# EAGLE board rtiduino (EAGLE 6.5.0)
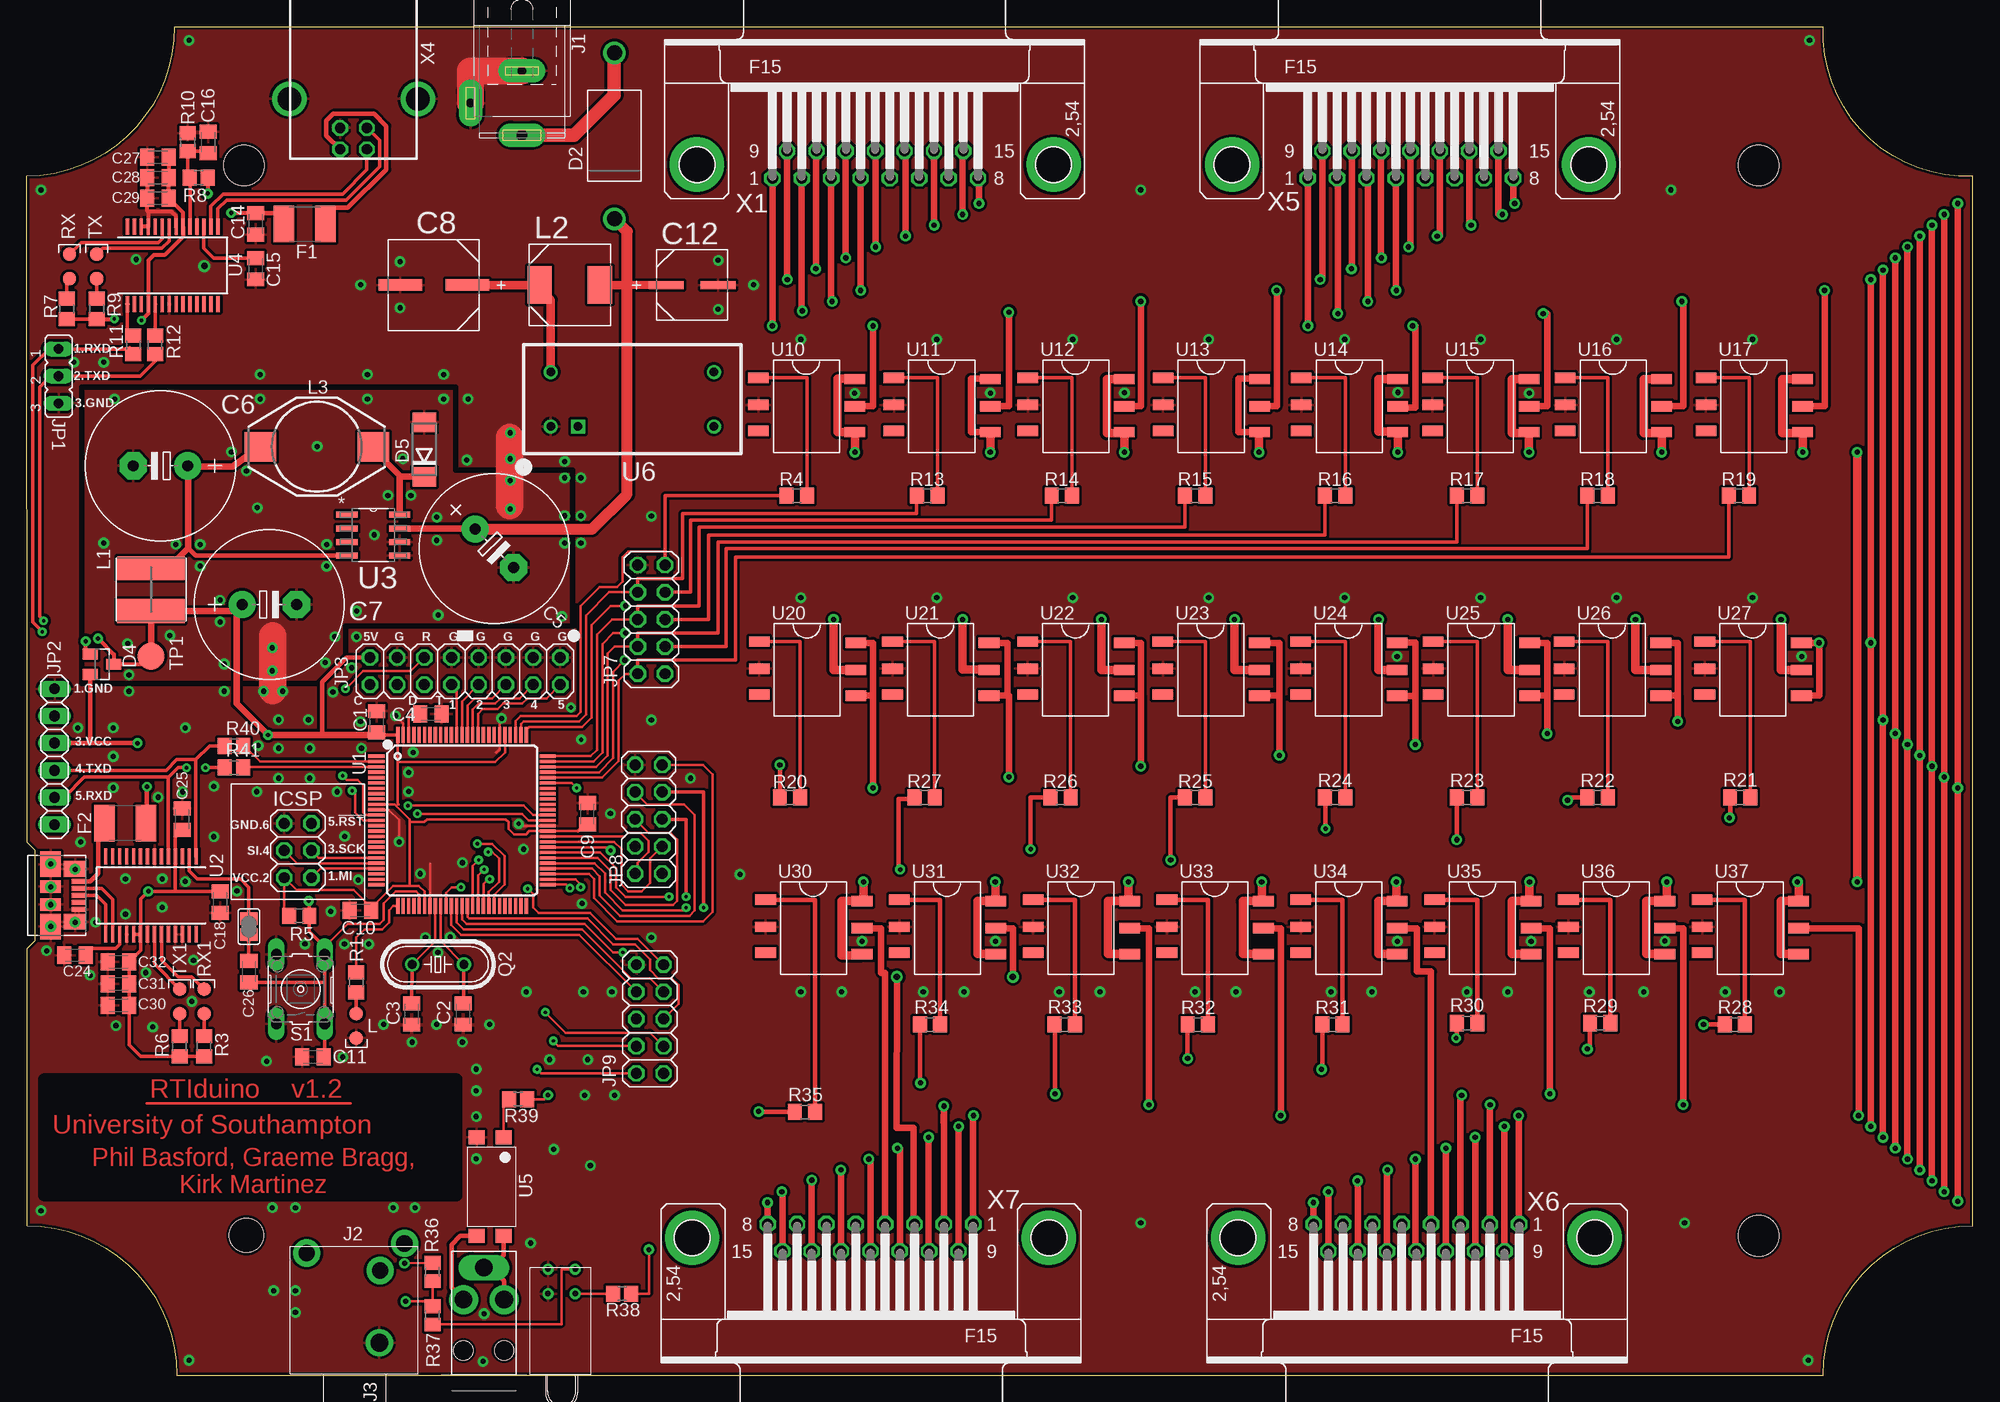
[diagram p4: board, top side]
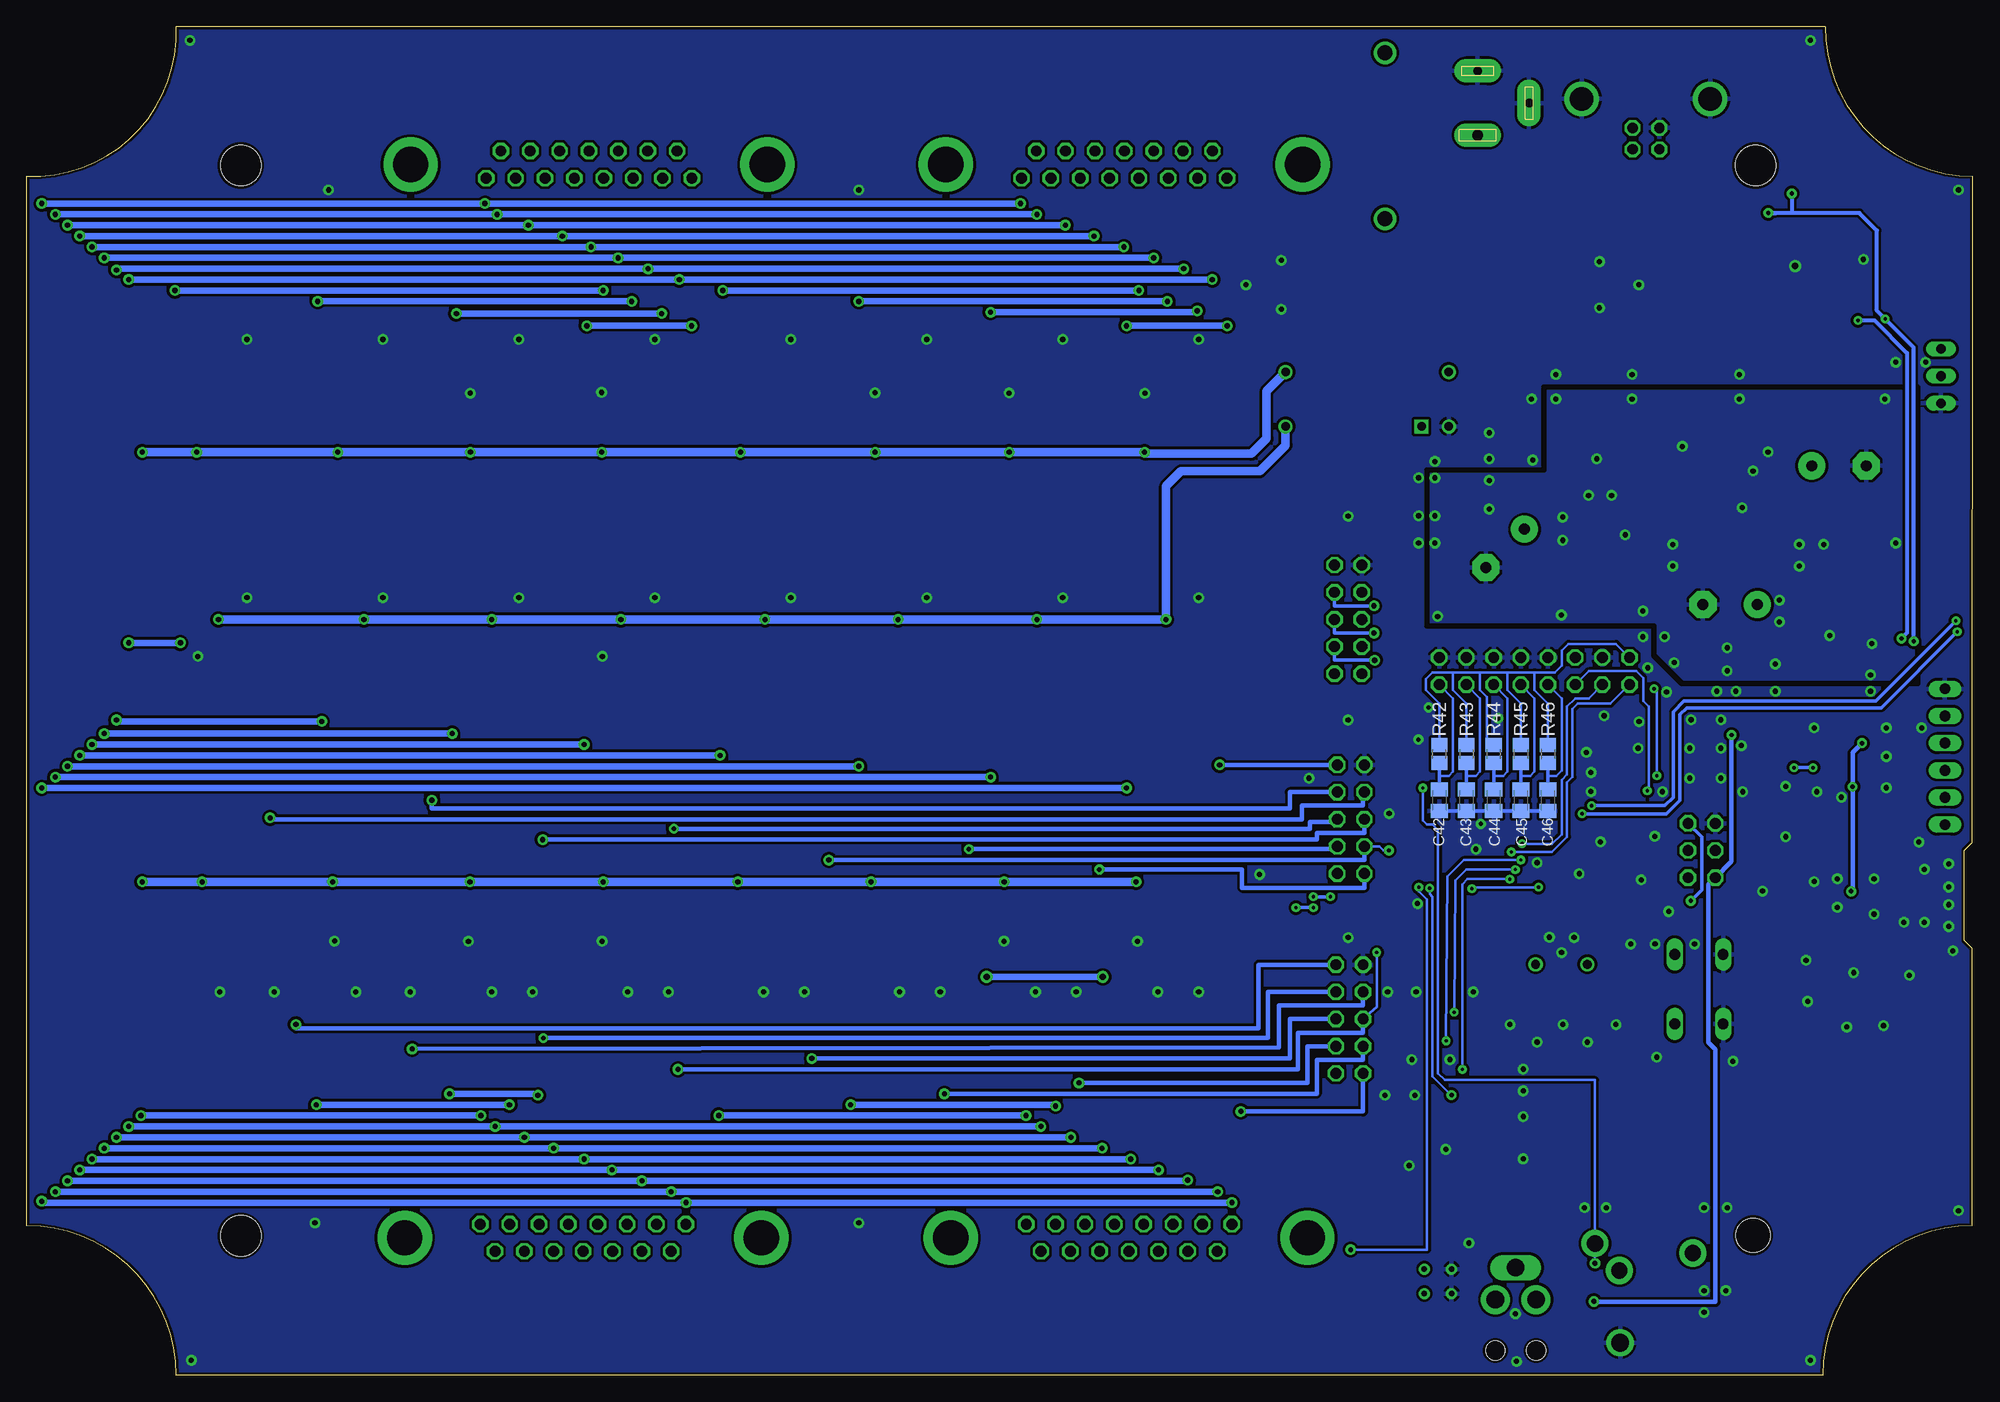
[diagram p5: board, bottom side, seen from below]

Size 181.79 x 125.98 mm. Coordinates in mm from the lower left corner, seen from the top.
Outline: 14.02,0 167.82,0 arc-90 181.79,13.97 181.79,112.01 arc-95 167.82,125.98 13.77,125.98 arc-90 0,112.01 0.05,49.78 0.81,49.02 0.81,40.64 0.05,39.88 0.05,13.97 arc-90 14.02,0
Copper layers (1*16): Top 0.035mm / dielectric 1.5mm / Bottom 0.035mm
Design rules "pcbtrain *": minimum track width 0.2mm, minimum drill 0.2mm, track to track 0.2mm, track to pad 0.2mm, pad to pad 0.2mm, via to via 0.2mm, smd to smd 0mil, copper to edge 10mil, drill to drill 0.2mm, minimum pad ring 10mil, minimum via ring 10mil, stop-mask expansion 0.125mm, vias tented up to drill 50mil, thermal gap 10mil
Net classes: 0 default: width 0.203 mm, drill 0.2 mm, clearance 0.127 mm; 1 power: width 0.203 mm, drill 0.2 mm, clearance 0.127 mm; 2 gnd: width 0.203 mm, drill 0.2 mm, clearance 0.127 mm; 3 usbvcc: width 0.203 mm, drill 0.2 mm, clearance 0.127 mm
Holes 3.2 mm at 20.53,13.06
Holes 3.8 mm at 20.29,113.02 161.79,113.02 161.79,13.02
tRestrict: 9 lines
bRestrict: 9 lines

## Footprints (pad centres in the part's own frame; a part is rotated, then mirrored left to right if it is on the bottom)
C0805K = smd 1.3 x 1.6: 1 -1,0; 2 1,0
E5-13 = drill 1.016 pad 2.54: + -2.54,0 | drill 1.016 pad 2.54 octagon: - 2.54,0
CAPAE830X1050N = smd 4.064 x 1.092: 1 -3.124,0; 2 3.124,0
CAPAE660X610N = smd 3.251 x 0.762: 1 -2.413,0; 2 2.413,0
DO-201AD = drill 1.4: 1 -12,-2.5; 2 3.5,-2.5
SOT23 = smd 1 x 1.4: 1 -0.95,-1.1; 2 0.95,-1.1; 3 0,1.1
DO214AA = smd 1.8 x 2.2: A 2.55,0; C -2.55,0
L1812 = smd 1.9 x 3.4: 1 -1.95,0; 2 1.95,0
2X03 = drill 1.016 octagon: 1 -2.54,-1.27; 2 -2.54,1.27; 3 0,-1.27; 4 0,1.27; 5 2.54,-1.27; 6 2.54,1.27
SPC4077 = drill 0.8 pad 2.184 long: 1 -3,0; 2 0,-4.8 | drill 1 pad 2.184 long: 3 3,0
3.5-JACK-RA = drill 1.651 pad 2.54: 1 8.319,2.921 | drill 1.524 pad 2.54: 2 1.524,11.303; 3 10.668,12.192; 4 8.382,9.652
2.5-JACK-RA-PRO = drill 1.65 pad 2.7: R 8.5,-1.9; S 8.5,1.9 | drill 1.6 long: T 11.5,0 | hole 1.8: 3.75,1.9; 3.75,-1.9
MOLEX_47346-0001 = smd 0.45 x 1.38: 1 -1.3,0; 2 -0.65,0; 3 0,0; 4 0.65,0; 5 1.3,0 | smd 1.475 x 2.1: M1 -2.462,-0.36; M2 2.462,-0.36 | smd 2.375 x 1.9: M3 -2.913,-2.66; M6 2.913,-2.66 | smd 1.175 x 1.9: M4 -0.82,-2.66; M5 0.85,-2.66
JP2 = drill 0.914 long: 1 -2.54,0; 2 0,0; 3 2.54,0
1X06 = drill 1.016 long: 1 -6.35,0; 2 -3.81,0; 3 -1.27,0; 4 1.27,0; 5 3.81,0; 6 6.35,0
2X08 = drill 1.016 octagon: 1 -8.89,-1.27; 2 -8.89,1.27; 3 -6.35,-1.27; 4 -6.35,1.27; 5 -3.81,-1.27; 6 -3.81,1.27; 7 -1.27,-1.27; 8 -1.27,1.27; 9 1.27,-1.27; 10 1.27,1.27; 11 3.81,-1.27; 12 3.81,1.27; 13 6.35,-1.27; 14 6.35,1.27; 15 8.89,-1.27; 16 8.89,1.27
2X05 = drill 1.016 octagon: 1 -5.08,-1.27; 2 -5.08,1.27; 3 -2.54,-1.27; 4 -2.54,1.27; 5 0,-1.27; 6 0,1.27; 7 2.54,-1.27; 8 2.54,1.27; 9 5.08,-1.27; 10 5.08,1.27
0805RND = smd 1.27 x 1.27: P$1 -1.143,0; P$2 1.143,0
WE-TPC_5818/5828 = smd 2.2 x 6.3: 1 -2,0; 2 2.01,0
INDM7676X355N = smd 2.261 x 3.505: 1 -2.819,0; 2 2.819,0
DO3316P = smd 2.92 x 2.79: 1 -5.28,0; 2 5.28,0
HC49/S = drill 0.813: 1 -2.413,0; 2 2.413,0
R0805 = smd 1.3 x 1.5: 1 -0.95,0; 2 0.95,0
R0805' = smd 1.3 x 1.5: 1 -0.85,0; 2 0.85,0
SJ = smd 1.168 x 1.6: 1 -0.762,0; 2 0.762,0
B3F-10XX = drill 1.016 long: 1 -3.251,2.261; 2 3.251,2.261; 3 -3.251,-2.261; 4 3.251,-2.261
B2,54 = smd 2.54 x 2.54: TP 0,0
TQFP100 = smd 1.5 x 0.3: 1 -8,6; 2 -8,5.5; 3 -8,5; 4 -8,4.5; 5 -8,4; 6 -8,3.5; 7 -8,3; 8 -8,2.5; 9 -8,2; 10 -8,1.5; 11 -8,1; 12 -8,0.5; 13 -8,0; 14 -8,-0.5; 15 -8,-1; 16 -8,-1.5; 17 -8,-2; 18 -8,-2.5; 19 -8,-3; 20 -8,-3.5; 21 -8,-4; 22 -8,-4.5; 23 -8,-5; 24 -8,-5.5; 25 -8,-6; 51 8,-6; 52 8,-5.5; 53 8,-5; 54 8,-4.5; 55 8,-4; 56 8,-3.5; 57 8,-3; 58 8,-2.5; 59 8,-2; 60 8,-1.5; 61 8,-1; 62 8,-0.5; 63 8,0; 64 8,0.5; 65 8,1; 66 8,1.5; 67 8,2; 68 8,2.5; 69 8,3; 70 8,3.5; 71 8,4; 72 8,4.5; 73 8,5; 74 8,5.5; 75 8,6 | smd 0.3 x 1.5: 26 -6,-8; 27 -5.5,-8; 28 -5,-8; 29 -4.5,-8; 30 -4,-8; 31 -3.5,-8; 32 -3,-8; 33 -2.5,-8; 34 -2,-8; 35 -1.5,-8; 36 -1,-8; 37 -0.5,-8; 38 0,-8; 39 0.5,-8; 40 1,-8; 41 1.5,-8; 42 2,-8; 43 2.5,-8; 44 3,-8; 45 3.5,-8; 46 4,-8; 47 4.5,-8; 48 5,-8; 49 5.5,-8; 50 6,-8; 76 6,8; 77 5.5,8; 78 5,8; 79 4.5,8; 80 4,8; 81 3.5,8; 82 3,8; 83 2.5,8; 84 2,8; 85 1.5,8; 86 1,8; 87 0.5,8; 88 0,8; 89 -0.5,8; 90 -1,8; 91 -1.5,8; 92 -2,8; 93 -2.5,8; 94 -3,8; 95 -3.5,8; 96 -4,8; 97 -4.5,8; 98 -5,8; 99 -5.5,8; 100 -6,8
SSOP28 = smd 0.381 x 1.499: 1 -4.225,-3.625; 2 -3.575,-3.625; 3 -2.925,-3.625; 4 -2.275,-3.625; 5 -1.625,-3.625; 6 -0.975,-3.625; 7 -0.325,-3.625; 8 0.325,-3.625; 9 0.975,-3.625; 10 1.625,-3.625; 11 2.275,-3.625; 12 2.925,-3.625; 13 3.575,-3.625; 14 4.225,-3.625; 15 4.225,3.625; 16 3.575,3.625; 17 2.925,3.625; 18 2.275,3.625; 19 1.625,3.625; 20 0.975,3.625; 21 0.325,3.625; 22 -0.325,3.625; 23 -0.975,3.625; 24 -1.625,3.625; 25 -2.275,3.625; 26 -2.925,3.625; 27 -3.575,3.625; 28 -4.225,3.625
SOIC127P620X175-8N = smd 1.981 x 0.559: 1 -2.464,1.905; 2 -2.464,0.635; 3 -2.464,-0.635; 4 -2.464,-1.905; 5 2.464,-1.905; 6 2.464,-0.635; 7 2.464,0.635; 8 2.464,1.905
DIP4-SMD = smd 1.3 x 1.5: P$1 -4.65,-4.15; P$2 -4.65,-6.68; P$3 4.55,-6.68; P$4 4.55,-4.15
LDU08 = drill 0.8: 1 -7.62,-2.54; 7 7.62,-2.54; 8 7.62,2.54; 14 -7.62,2.54 | drill 0.8 square: 2 -5.08,-2.54
SOP6 = smd 1.93 x 0.965: 1 -4.318,6.985; 2 -4.318,4.445; 3 -4.318,2.032; 4 4.699,1.905; 5 4.699,4.318; 6 4.699,6.858
122-000-04-52 = drill 0.508: P$1 -1.27,4.826; P$2 1.27,4.826; P$3 -1.27,2.54; P$4 1.27,2.54
F15HP = drill 1.016 octagon: 1 -9.601,-1.27; 2 -6.858,-1.27; 3 -4.115,-1.27; 4 -1.372,-1.27; 5 1.372,-1.27; 6 4.115,-1.27; 7 6.858,-1.27; 8 9.601,-1.27; 9 -8.23,1.27; 10 -5.486,1.27; 11 -2.743,1.27; 12 0,1.27; 13 2.743,1.27; 14 5.486,1.27; 15 8.23,1.27 | drill 3.302 pad 5.08: G1 -16.662,0; G2 16.662,0
PN61729 = drill 0.95 octagon: 1 1.25,4.71; 2 -1.25,4.71; 3 -1.25,2.71; 4 1.25,2.71 | drill 2.2: P$1 -6,0; P$2 6,0

## Placement (x,y rotation side)
C1  100n  [C0805K]  32.69,61.04 90 top
C2  22p  [C0805K]  40.77,33.75 90 top
C3  22p  [C0805K]  35.94,33.75 90 top
C4  100n  [C0805K]  37.76,61.78 0 top
C5  68uF  [E5-13]  43.67,77.25 315 top
C6  120uF  [E5-13]  12.5,84.96 180 top
C7  100uF  [E5-13]  22.66,72.01 0 top
C8  47UF  [CAPAE830X1050N]  38.02,101.85 180 top
C9  100n  [C0805K]  52.38,52.45 90 top
C10  100n  [C0805K]  31.17,43.43 180 top
C11  22p  [C0805K]  26.74,29.74 180 top
C12  10UF  [CAPAE660X610N]  62.16,101.85 0 top
C14  100n  [C0805K]  21.39,107.57 270 top
C15  100n  [C0805K]  21.39,103.38 90 top
C16  100n  [C0805K]  16.94,115.19 270 top
C18  100nF  [C0805K]  18.09,44.2 270 top
C24  100nF  [C0805K]  4.5,39.24 0 top
C25  100nF  [C0805K]  14.53,51.94 90 top
C26  100nF  [C0805K]  20.75,37.72 270 top
C27  100nF  [C0805K]  12.24,113.79 180 top
C28  100nF  [C0805K]  12.24,111.89 180 top
C29  4.7uF  [C0805K]  12.24,109.98 180 top
C30  100nF  [C0805K]  8.56,34.54 180 top
C31  100nF  [C0805K]  8.56,36.58 180 top
C32  4.7uF  [C0805K]  8.56,38.61 180 top
C42  100n  [C0805K]  49.84,53.72 270 bottom
C43  100n  [C0805K]  47.3,53.72 270 bottom
C44  100n  [C0805K]  44.76,53.72 270 bottom
C45  100n  [C0805K]  42.22,53.72 270 bottom
C46  100n  [C0805K]  39.68,53.72 270 bottom
D2  SF37  [DO-201AD]  52.4,120.04 90 top
D4  BAT54C  [SOT23]  7.04,66.42 270 top
D5  MBRS130  [DO214AA]  37.14,86.49 90 top
F1  500mA  [L1812]  25.96,107.57 0 top
F2  500mA  [L1812]  9.2,51.56 180 top
ICSP  ICSP  [2X03]  25.32,49.02 90 top
J1  DCJ0202  [SPC4077]  46.25,118.85 270 top
J2  3.5MM-JACK  [3.5-JACK-RA]  24.62,0.12 0 top
J3  2.5MM-JACKPRO  [2.5-JACK-RA-PRO]  42.7,-1.44 90 top
J4  USB PROG  [MOLEX_47346-0001]  4.88,44.83 270 top
JP1  [JP2]  2.97,93.34 270 top
JP2  [1X06]  2.59,57.78 270 top
JP3  [2X08]  40.95,65.79 0 top
JP7  [2X05]  58.34,70.61 90 top
JP8  [2X05]  58.09,51.94 90 top
JP9  [2X05]  58.22,33.27 90 top
L  [0805RND]  30.79,32.64 270 top
L1  3uH  [WE-TPC_5818/5828]  11.61,73.41 270 top
L2  DR73-680-R  [INDM7676X355N]  50.73,101.85 0 top
L3  330uH (DO3308P-334)  [DO3316P]  27.1,86.74 180 top
Q2  16MHz  [HC49/S]  38.42,38.39 180 top
R1  1K  [R0805]  30.79,36.7 270 top
R3  1k  [R0805]  16.56,30.73 270 top
R4  560  [R0805]  71.93,82.17 0 top
R5  10K  [R0805]  25.45,42.93 180 top
R6  1k  [R0805]  14.28,30.73 270 top
R7  1k  [R0805]  3.74,99.63 270 top
R8  4K7  [R0805']  16.05,111.89 180 top
R9  1k  [R0805]  6.53,99.63 270 top
R10  10K  [R0805']  15.04,115.19 90 top
R11  1K  [R0805']  9.96,96.27 270 top
R12  1K  [R0805']  11.99,96.27 270 top
R13  560  [R0805]  84.13,82.17 0 top
R14  560  [R0805]  96.7,82.17 0 top
R15  560  [R0805]  109.15,82.17 0 top
R16  560  [R0805]  122.23,82.17 0 top
R17  560  [R0805]  134.54,82.17 0 top
R18  560  [R0805]  146.74,82.17 0 top
R19  560  [R0805]  159.94,82.17 0 top
R20  560  [R0805]  71.3,53.98 0 top
R21  560  [R0805]  160.07,53.98 0 top
R22  560  [R0805]  146.74,53.98 0 top
R23  560  [R0805]  134.54,53.98 0 top
R24  560  [R0805]  122.23,53.98 0 top
R25  560  [R0805]  109.15,53.98 0 top
R26  560  [R0805]  96.57,53.98 0 top
R27  560  [R0805]  83.87,53.98 0 top
R28  560  [R0805]  159.56,32.77 0 top
R29  560  [R0805]  146.99,32.89 0 top
R30  560  [R0805]  134.54,32.89 0 top
R31  560  [R0805]  121.97,32.77 0 top
R32  560  [R0805]  109.4,32.77 0 top
R33  560  [R0805]  96.95,32.77 0 top
R34  560  [R0805]  84.38,32.77 0 top
R35  560  [R0805]  72.7,24.59 0 top
R36  10K  [R0805']  37.9,9.65 90 top
R37  560  [R0805']  37.9,5.59 270 top
R38  560  [R0805']  55.61,7.62 180 top
R39  560  [R0805']  45.9,25.78 180 top
R40  1K  [R0805']  19.36,58.8 0 top
R41  1K  [R0805']  19.36,56.77 0 top
R42  10k  [R0805']  49.84,58.04 270 bottom
R43  10k  [R0805']  47.3,58.04 270 bottom
R44  10k  [R0805']  44.76,58.04 270 bottom
R45  10k  [R0805']  42.22,58.04 270 bottom
R46  10k  [R0805']  39.68,58.04 270 bottom
RESET-EN  [SJ]  20.75,41.91 270 top
RX  [0805RND]  3.99,103.6 90 top
RX1  [0805RND]  16.56,34.92 90 top
S1  [B3F-10XX]  25.58,36.07 90 top
TP1  TPB2,54  [B2,54]  11.61,67.18 180 top
TX  [0805RND]  6.53,103.6 90 top
TX1  [0805RND]  14.28,34.92 90 top
U1  ATMEGA2560AU  [TQFP100]  40.66,51.83 0 top
U2  FT232RL  [SSOP28]  11.61,44.83 180 top
U3  LM2594HVM-5.0  [SOIC127P620X175-8N]  32.38,78.49 0 top
U4  FT232RL  [SSOP28]  13.63,103.69 0 top
U5  FOD852  [DIP4-SMD]  48.69,17.56 270 top
U6  LED-DRIVER  [LDU08]  56.57,91.19 0 top
U10  AQV252G  [SOP6]  72.67,86.21 0 top
U11  AQV252G  [SOP6]  85.31,86.21 0 top
U12  AQV252G  [SOP6]  97.83,86.21 0 top
U13  AQV252G  [SOP6]  110.48,86.21 0 top
U14  AQV252G  [SOP6]  123.38,86.21 0 top
U15  AQV252G  [SOP6]  135.64,86.21 0 top
U16  AQV252G  [SOP6]  148.04,86.21 0 top
U17  AQV252G  [SOP6]  161.19,86.21 0 top
U20  AQV252G  [SOP6]  72.74,61.57 0 top
U21  AQV252G  [SOP6]  85.19,61.57 0 top
U22  AQV252G  [SOP6]  97.82,61.57 0 top
U23  AQV252G  [SOP6]  110.45,61.57 0 top
U24  AQV252G  [SOP6]  123.33,61.57 0 top
U25  AQV252G  [SOP6]  135.7,61.57 0 top
U26  AQV252G  [SOP6]  147.95,61.57 0 top
U27  AQV252G  [SOP6]  161.08,61.57 0 top
U30  AQV252G  [SOP6]  73.33,37.44 0 top
U31  AQV252G  [SOP6]  85.83,37.44 0 top
U32  AQV252G  [SOP6]  98.33,37.44 0 top
U33  AQV252G  [SOP6]  110.83,37.44 0 top
U34  AQV252G  [SOP6]  123.33,37.44 0 top
U35  AQV252G  [SOP6]  135.83,37.44 0 top
U36  AQV252G  [SOP6]  148.33,37.44 0 top
U37  AQV252G  [SOP6]  160.83,37.44 0 top
U$28  122-000-04-52  [122-000-04-52]  49.96,5.08 0 top
X1  [F15HP]  79.26,113.11 0 top
X4  [PN61729]  30.52,119.25 180 top
X5  [F15HP]  129.26,113.11 0 top
X6  [F15HP]  129.82,12.84 180 top
X7  [F15HP]  78.82,12.84 180 top

## Tracks (layer width: path | path; a pad name or v marks a point on that pad's centre or on a via)
+3V3
  Top 0.305: C15.2 17.47,104.38 16.55,105.29 U4.17
+3V3PROG
  Top 0.305: U2.17 8.68,40.26 8.31,39.88 6.02,39.88 C24.2
+5V  (via drill 0.3, 0.41, 0.46)
  Top 0.254: v35.39,6.89 37.86,6.89 37.9,6.86 R37.1 R36.1 | 35.77,51.56 35.77,51.94 34.38,53.33 U1.10 | 35.77,51.56 35.77,45.72 | 35.77,45.72 36.63,45.72 37.16,45.18 U1.31 | 35.77,45.72 34.21,45.72 32.44,43.94 C10.1 32.17,43.7 30.53,45.34 25.2,45.34 ICSP.2 24.05,43.37 R5.2 | 34.6,59.82 34.66,59.82 U1.100 34.66,57.28 | 51.52,50.83 U1.61 46.95,50.83 46.66,50.55 45.52,50.55 45.01,51.05 45.01,51.69 44.76,51.94 37.39,51.94 37.14,51.69 35.9,51.69 arc90 35.77,51.56 | 34.66,57.28 43.74,57.28 44.66,58.2 U1.80 | 34.66,57.28 34.66,53.34 34.72,53.34
  Top 0.305: 34.6,59.82 32.55,59.82 | 51.52,50.83 52.14,51.45 C9.1
  Top 0.356: C27.1 C28.1 C29.1 14.6,108.62 U4.20 14.6,106.37 12.88,104.65 11.86,104.65 11.35,104.14 U4.4 11.35,99.18 v10.72,98.55 | v6.66,68.83 8.14,67.35 D4.3 10.85,66.42 TP1.TP
  Top 0.406: 27.61,59.82 27.61,64.77 29.9,67.06 JP3.2
  Top 0.61: 19.61,71.5 19.5,71.4 L1.2 TP1.TP | 19.61,71.5 C7.+ | 19.61,71.5 19.61,62.74 v22.53,59.82 27.61,59.82 32.55,59.82 C1.1
  Bottom 0.254: R46.1 39.68,62.74 40.95,64.01 40.95,65.66 | R45.1 42.22,62.74 43.49,64.01 43.49,65.66 | R43.1 47.3,62.74 48.57,64.01 48.57,65.66 | 48.57,65.66 46.03,65.66 | 46.03,65.66 43.49,65.66 | 43.49,65.66 40.95,65.66 | 40.95,65.66 39.04,65.66 38.41,66.29 38.41,67.69 37.77,68.33 33.33,68.33 JP3.2 | 46.03,65.66 46.03,64.01 45.39,63.37 45.39,59.52 R44.1 | R42.1 49.84,62.74 51.11,64.01 51.11,65.02 50.47,65.66 48.57,65.66
  Bottom 0.356: v10.72,98.55 9.2,98.55 6.15,95.5 6.15,69.34 v6.66,68.83
  Bottom 0.406: v35.39,6.89 35.39,6.86 24.03,6.86 24.03,30.45 24.69,31.11 24.69,45.85 ICSP.2 22.53,48.01 v22.53,59.82
A0
  Top 0.254: U1.78 45.66,61.11 46.15,61.59 51.36,61.59 51.74,61.98 51.74,71.88 53.52,73.66 55.17,73.66 55.68,74.17 55.68,76.45 56.19,76.96 59.49,76.96 59.62,77.09
  Top 0.305: R4.1 59.62,82.17 59.62,77.09 JP7.9
A1
  Top 0.254: U1.77 46.16,60.84 46.41,61.09 51.61,61.09 52.25,61.72 52.25,70.99 54.41,73.15 JP7.8
  Top 0.305: 83.11,82.17 83.11,80.52 61.27,80.52 61.27,74.42 57.08,74.42 JP7.8
  Top 0.406: R13.1 83.11,82.17
A2  (via drill 0.48)
  Top 0.254: U1.76 46.66,60.33 | 46.66,60.33 46.66,60.45 | v55.93,71.88 54.53,71.88 52.76,70.1 52.76,61.47 51.87,60.58 46.92,60.58 46.66,60.33
  Top 0.305: R14.1 95.75,79.88 62.03,79.88 62.03,73.15 JP7.7
  Bottom 0.305: v55.93,71.88 59.62,71.88 JP7.7
A3
  Top 0.254: U1.75 52.68,57.83 53.27,58.42 53.27,69.22 54.66,70.61 JP7.6
  Top 0.305: R15.1 108.2,79.25 62.79,79.25 62.79,71.88 57.08,71.88 JP7.6
A4  (via drill 0.48)
  Top 0.254: U1.74 52.94,57.33 53.77,58.17 53.77,68.33 54.79,69.34 v55.93,69.34
  Top 0.305: R16.1 121.28,78.49 63.68,78.49 63.68,70.61 JP7.5
  Bottom 0.305: v55.93,69.34 59.62,69.34 JP7.5
A5
  Top 0.254: U1.73 53.2,56.83 54.28,57.91 54.28,67.44 54.92,68.07 JP7.4
  Top 0.305: R17.1 133.59,77.85 64.57,77.85 64.57,69.34 57.08,69.34 JP7.4
A6  (via drill 0.48)
  Top 0.254: U1.72 53.46,56.33 54.79,57.66 54.79,65.72 v55.87,66.8
  Top 0.305: R18.1 145.79,77.22 65.33,77.22 65.33,68.07 JP7.3
  Bottom 0.305: v55.87,66.8 59.62,66.8 JP7.3
A7
  Top 0.254: U1.71 53.73,55.83 55.3,57.4 55.3,64.9 55.93,65.53 JP7.2
  Top 0.305: R19.1 159,76.45 66.22,76.45 66.22,66.8 57.08,66.8 JP7.2
AREF
  Top 0.254: U1.98 35.66,61.52 35.87,61.72 36.96,61.72
  Top 0.305: 36.96,61.72 C4.1
B0  (via drill 0.48)
  Top 0.254: U1.53 52.53,46.83 53.01,46.35 53.01,44.58 55.17,42.42 63.17,42.42 64.06,43.31 64.06,56.13 63.17,57.02 JP8.9
  Top 0.406: R20.1 v70.35,57.02
  Bottom 0.406: v70.35,57.02 JP8.9
B1  (via drill 0.48)
  Top 0.254: U1.54 52.8,47.33 53.52,46.61 53.52,44.83 55.42,42.93 61.9,42.93 62.41,43.43 62.41,52.32 61.39,53.34 57.96,53.34 JP8.8
  Top 0.406: v159.06,52.07 159.12,52.07 R21.1
  Bottom 0.406: JP8.8 56.95,54.48 56.95,53.21 62.66,53.21 62.66,51.94 159.06,51.94 v159.06,52.07
B2  (via drill 0.3, 0.48)
  Top 0.254: U1.55 53.06,47.83 54.03,46.86 54.03,45.09 55.68,43.43 61.33,43.43 v61.58,43.69
  Top 0.305: v63.23,43.69 63.23,54.48 JP8.7
  Top 0.406: v143.94,53.72 143.94,53.98 R22.1
  Bottom 0.305: v61.58,43.69 v63.23,43.69
  Bottom 0.406: JP8.7 63.81,54.48 63.81,52.96 143.94,52.96 v143.94,53.72
B3  (via drill 0.48)
  Top 0.254: U1.56 53.32,48.33 54.53,47.12 54.53,45.34 55.93,43.94 60.38,43.94 60.76,44.32 60.76,50.04 60.12,50.67 58.09,50.67 JP8.6
  Top 0.406: v133.59,50.04 R23.1
  Bottom 0.406: JP8.6 56.82,50.67 61.27,50.67 61.27,50.04 v133.59,50.04
B4  (via drill 0.3, 0.41)
  Top 0.254: U1.57 48.79,48.83 53.58,48.83 55.04,47.37 55.04,45.59 55.93,44.7 v60,44.7
  Top 0.305: v61.58,44.7 61.58,51.94 JP8.5
  Top 0.406: R24.1 121.34,53.98 v121.34,51.05
  Bottom 0.305: v60,44.7 v61.58,44.7
  Bottom 0.406: v121.34,51.05 61.9,51.05 61.9,51.69 59.36,51.69 JP8.5
B5  (via drill 0.41, 0.48)
  Top 0.254: U1.58 54.23,49.33 v54.53,49.02
  Top 0.406: R25.1 106.86,53.98 v106.86,48.13
  Bottom 0.254: v54.53,49.02 55.04,49.02 55.42,49.4 JP8.4
  Bottom 0.406: v106.86,48.13 56.82,48.13 JP8.4
B6  (via drill 0.41)
  Top 0.254: U1.59 54.87,49.83 55.55,49.15 55.55,45.85 56.19,45.21 57.46,45.21 58.22,45.97 58.22,48.26 JP8.3
  Top 0.406: R26.1 93.78,53.98 v93.78,49.15
  Bottom 0.406: v93.78,49.15 59.36,49.15 JP8.3
B7  (via drill 0.41)
  Top 0.254: U1.60 55.84,50.33 56.19,50.67 57.33,50.67 58.09,49.91 58.09,48.9 57.08,47.88 57.08,47.37 56.82,47.12 JP8.2
  Top 0.406: R27.1 82.92,53.85 81.46,53.85 81.46,47.24 v81.59,47.24
  Bottom 0.406: v81.59,47.24 68.25,47.24 68.25,45.53 56.82,45.53 JP8.2
C0  (via drill 0.3, 0.48)
  Top 0.254: JP9.9 57.08,40.77 55.04,40.77 52.63,43.18 47.8,43.18 47.3,43.69 47.3,44.58 47.3,44.83 47.3,44.96 v46.79,45.47 | U1.35 39.16,45.08 39.68,45.59 v40.56,45.59
  Top 0.406: v156.64,32.77 R28.1
  Bottom 0.254: v40.56,45.59 46.66,45.59 v46.79,45.47
  Bottom 0.406: JP9.9 66.73,38.35 66.73,32.38 156.64,32.38 v156.64,32.77
C1  (via drill 0.48)
  Top 0.254: U1.36 39.66,42.05 40.56,41.15 51.61,41.15 JP9.8
  Top 0.406: v145.78,30.48 146.04,30.73 R29.1
  Bottom 0.406: JP9.8 56.95,34.54 64.82,34.54 64.82,30.61 v145.78,30.48
C2  (via drill 0.41)
  Top 0.254: U1.37 40.16,42.31 40.82,41.66 51.87,41.66 56.44,37.08 58.22,37.08 JP9.7
  Top 0.305: 59.55,35.81 JP9.7
  Top 0.406: v133.53,31.5 133.59,31.5 R30.1
  Bottom 0.406: JP9.7 65.84,35.81 65.84,31.5 v133.53,31.5
C3  (via drill 0.3, 0.48)
  Top 0.254: U1.38 40.66,42.57 41.07,42.16 52.12,42.16 54.79,39.5 v55.68,39.5
  Top 0.406: v120.96,28.57 121.02,28.57 R31.1
  Bottom 0.254: v55.68,39.5 55.68,34.42 JP9.6
  Bottom 0.406: JP9.6 56.95,32 63.04,32 63.04,28.57 v120.96,28.57
C4  (via drill 0.48)
  Top 0.254: U1.39 41.16,42.83 41.33,42.67 52.38,42.67 54.79,40.26 56.82,40.26 58.22,38.86 58.22,37.85 58.98,37.08 60.25,37.08 60.88,36.45 60.88,34.67 JP9.5
  Top 0.406: v108.45,29.59 108.45,29.34 R32.1
  Bottom 0.406: JP9.5 63.81,33.27 63.81,29.59 v108.45,29.59
C5  (via drill 0.3, 0.48)
  Top 0.254: JP9.4 56.95,30.79 49.66,30.79 v49.2,31.24 | U1.40 41.66,47.58 v42.22,48.13
  Top 0.406: v96.06,26.29 96.06,32.77 R33.1
  Bottom 0.254: v49.2,31.24 49.07,46.61 47.55,48.13 v42.22,48.13
  Bottom 0.406: JP9.4 56.95,29.46 61.27,29.46 61.27,26.29 v96.06,26.29
C6  (via drill 0.3, 0.48)
  Top 0.254: U1.41 42.16,46.68 v42.72,47.24 | v48.44,33.91 50.34,32 58.22,32 JP9.3
  Top 0.406: v83.49,27.3 83.43,27.05 R34.1
  Bottom 0.254: v48.44,33.91 48.31,46.23 47.3,47.24 v42.72,47.24
  Bottom 0.406: JP9.3 62.16,30.73 62.16,27.3 v83.49,27.3
C7  (via drill 0.3, 0.48)
  Top 0.254: U1.42 42.66,45.91 43.1,46.35 v43.23,46.35 | JP9.2 48.06,28.19 v47.68,28.57
  Top 0.406: v68.38,24.64 68.38,24.59 R35.1
  Bottom 0.254: v47.68,28.57 47.68,45.87 47.19,46.35 v43.23,46.35
  Bottom 0.406: JP9.2 56.95,24.64 v68.38,24.64
D+
  Top 0.305: U4.15 17.85,108.98 18.67,109.8 29.85,109.8 32.95,112.9 32.95,115.36 X4.3
D-
  Top 0.305: X4.2 31.77,112.62 29.52,110.36 18.34,110.36 17.2,109.22 U4.16
FIRE  (via drill 0.3, 0.46)
  Top 0.254: R36.2 v35.29,10.46 | U1.70 50.89,55.33 v51.36,54.86
  Bottom 0.254: v35.29,10.46 J2.3 35.29,27.58 49.33,27.58 49.96,28.22 49.96,50.93 50.47,51.44 50.98,51.44 51.36,51.82 v51.36,54.86
GND  (via drill 0.41, 0.48, 0.6)
  Top 0.254: U1.11 33.81,52.83 34.77,51.87 v34.77,49.84 | U1.32 37.66,47.78 | U1.62 45.95,51.33 | U1.99 35.16,60.9 v34.44,61.62 | 44.16,61.69 v44.35,61.37 44.38,61.34 | 43.87,58.17 44.16,58.46 U1.81 44.16,61.13 44.38,61.34 | 44.38,61.34 44.63,61.09
  Top 0.305: U4.25 | 45.95,51.33 v45.95,51.51
  Top 0.356: U4.21 13.95,108.28 13.51,108.71 11.35,108.71 | 11.35,108.71 U4.25 U4.26 | 11.35,108.71 11.24,108.82 C29.2 C28.2
  Top 2.54: J1.2 41.45,121.85 J1.1
  Top 2.591: 45.11,81.25 45.11,87.61 | 22.99,63.98 22.99,69.06
  Bottom 0.305: C42.2 C43.2 C44.2 C45.2 C46.2
  other vias: 36.09,58.19 77.34,91.74 102.54,91.8 128.09,91.82 140.36,91.74 128.02,67.16 140.54,40.54 153.04,40.56 90.5,40.54 51.79,59.39 78.03,40.54 128.04,40.54 165.81,67.16 90.02,91.77 66.63,46.79 10.21,104.24 16.59,103.63 14.56,54.51 9.22,46.38 12.65,46.38 5.03,49.81 6.43,42.32 28.4,43.33 11.76,32.54 15.57,38.76 12.65,43.71 17.48,50.32 14.81,60.48 21.54,81.05 32.46,78.51 45.16,83.59 45.16,80.92 22.94,65.81 22.94,67.97 54.51,52.48 18.44,66.45 9.55,65.43 13.36,69.11 9.42,68.35 16.21,77.62 16.21,75.59 28.02,77.62 28.02,75.59 33.73,82.19 35.89,82.19 19.13,86.26 38.3,78 38.3,80.16 7.19,94.64 4.4,94.64 12.27,54 52.4,29.49 48.85,29.49 40.69,31.11 35.99,31.11 38.28,32.77 43.23,32.77 33.33,32.77 51.87,44.07 46.41,49.15 36.76,46.86 40.69,47.88 1.32,15.37 15.16,1.4 1.32,110.74 15.16,124.71 166.55,124.71 166.42,1.4 13.92,77.62 20.52,84.48 35.13,85.62 50.24,80.29 50.24,77.75 18.06,70.38 18.06,72.42 38.43,71.02 38.41,39.5 39.55,40.92 37.24,40.89 58.34,61.21 58.34,40.89 58.34,80.26 50.83,62.38 31.27,58.57 26.44,58.57 26.32,61.24 28.98,54.51 26.44,55.78 21.49,54.51 23.52,55.78 21.62,58.83 23.52,58.57 22.12,63.91 23.9,63.91 23.52,61.24 18.44,63.91 45.16,85.62 45.16,88.04 38.94,91.21 50.24,83.85 30.96,46.28 51.99,35.81 46.66,35.81 49.23,21.11 52.66,19.58 22.4,29.34 29.52,29.72 19.64,45.24 14.81,46.13 8.08,54.89 8.08,57.81 8.08,60.48 4.78,60.48 104.07,110.74 153.59,110.74 97.72,96.77 110.42,96.77 85.02,96.77 72.32,96.77 123.12,96.77 135.81,96.77 148.51,96.77 161.22,96.77 85.02,72.64 97.72,72.64 72.32,72.64 110.42,72.64 123.12,72.64 135.81,72.64 148.51,72.64 161.22,72.64 72.32,35.81 83.75,35.81 96.45,35.81 109.15,35.81 121.85,35.81 134.54,35.81 145.97,35.81 158.67,35.81 163.75,35.81 151.05,35.81 138.35,35.81 125.66,35.81 112.96,35.81 100.26,35.81 87.56,35.81 76.12,35.81 104.07,14.22 154.86,14.22 27.89,66.57 49.99,70.89 8.21,91.21 21.79,91.21 31.83,91.21 27.13,86.77 41.1,85.5 21.79,93.5 31.83,93.5 38.94,93.5 41.23,91.21 51.77,83.85 50.24,85.37 51.77,77.75 51.77,80.29 9.55,63.91 7.19,77.75 30.81,68.99 28.78,68.99 30.81,71.4 34.88,104.04 34.88,99.72 31.19,101.88 67.9,101.88 64.59,104.17 64.59,99.59 2.24,41.94 2.24,47.78 4.52,47.27 4.52,42.32 2.24,43.97 2.24,45.62 1.86,39.65 9.22,43.08 5.92,37.36 8.33,32.66 11.13,37.62 29.67,40.28 31.95,40.28 25.99,40.28 29.69,50.34 17.48,55.02 41.99,24.16 41.99,20.22 47.07,12.34 42.72,5.74 42.62,1.3 31.17,61.06 30.35,66.09 28.6,63.83 15.42,34.92 25.1,7.9 25.1,5.87 23.06,7.9 36.27,15.65 34.24,15.65 22.94,15.65 25.1,15.65 41.99,26.57 41.99,28.6 62,55.78 35.66,56.31 35.66,54.53 54.66,35.81 52.12,26.16 54.92,26.16
  pour Bottom (isolate 0.254): -5.71,137.52 188.29,137.52 188.29,-13.48 -5.71,-13.48
  pour Top (isolate 0.254): -3.71,135.52 186.58,135.4 186.58,-9.6 -3.71,-9.48
  pour Top (isolate 0.254): 37.33,45.21 37.33,40.58 32.5,40.58 32.5,31.11 44.45,31.11 44.44,40.7 39.61,40.7 39.42,45.21
  pour Bottom (isolate 0.254): 39.49,45.21 37.33,45.21 37.33,41.91 32.5,41.91 32.5,31.11 44.44,31.11 44.44,41.91 39.49,41.91
LED_GND  (via drill 0.48)
  Top 0.813: U21.5 89.89,65.91 87.43,65.91 v87.43,70.61 | U27.5 163.88,65.89 v163.88,70.61 | U26.5 150.29,65.89 v150.29,70.61 | U25.5 138.35,65.89 v138.35,70.61 | U24.5 126.29,65.89 v126.29,70.61 | U23.5 112.83,65.89 v112.83,70.61 | U22.5 100.38,65.89 v100.38,70.61 | U20.5 75.36,65.89 v75.36,70.61
  Bottom 0.813: v163.88,70.61 v150.29,70.61 v138.35,70.61 v126.29,70.61 v112.83,70.61 v100.38,70.61 v87.43,70.61 v75.36,70.61 75.36,83.06 73.97,84.45 66.6,84.45 64.19,86.87 U6.7
LED_VCC  (via drill 0.48)
  Top 0.61: 78.16,44.3 U30.6 | 78.03,39.24 U30.4 | U31.6 90.48,44.3 | 90.53,39.37 U31.4 | U32.6 102.92,44.3 | 103.03,39.37 U32.4 | U33.6 115.37,44.3 | 115.53,39.37 U33.4 | U34.6 127.94,44.3 | 128.03,39.37 U34.4 | U35.6 140.39,44.3 | 140.53,39.37 U35.4 | U36.6 153.21,44.3 | 153.03,39.37 U36.4 | 165.53,39.37 U37.4 | U11.4 88.19,88.11 88.19,93.09 90.01,93.09 U11.6 | U13.4 113.21,88.11 113.21,93.09 115.18,93.09 U13.6
  Top 0.813: U10.6 77.37,93.09 75.74,93.09 75.74,88.11 U10.4 v77.37,86.23 | v115.11,86.23 115.11,88.11 U13.4 | v102.53,86.23 U12.4 102.53,88.01 100.89,88.01 100.89,93.07 U12.6 | U11.4 v90.01,86.23 | v165.91,86.23 165.91,88.11 U17.4 165.89,88.01 164.01,88.01 164.01,93.07 U17.6 | v152.73,86.23 U16.4 152.73,88.01 151.05,88.01 151.05,93.07 U16.6 | v140.34,86.23 U15.4 140.34,88.01 138.74,88.01 138.74,93.07 U15.6 | v128.08,86.23 U14.4 128.08,88.14 126.29,88.14 126.29,93.07 U14.6 | v165.41,46.1 165.53,46.1 U37.6 163.88,44.3 163.88,39.37 165.53,39.37 | v78.16,46.1 78.16,44.3 | U30.6 76.12,44.3 76.12,39.24 78.03,39.24 | 90.48,44.3 v90.48,46.1 | U31.6 88.83,44.3 88.83,39.37 90.53,39.37 | 102.92,44.3 v102.92,46.1 | U32.6 101.02,44.3 101.02,39.37 103.03,39.37 | 115.37,44.3 v115.37,46.1 | U33.6 113.59,44.3 113.59,39.37 115.53,39.37 | 127.94,44.3 v127.94,46.1 | U34.6 126.29,44.3 126.29,39.37 128.03,39.37 | 140.39,44.3 v140.39,46.1 | U35.6 138.74,44.3 138.74,39.37 140.53,39.37 | 153.21,44.3 v153.21,46.1 | U36.6 151.31,44.3 151.31,39.37 153.03,39.37 | v170.99,86.23 v170.99,46.1
  Bottom 0.813: v78.16,46.1 v90.48,46.1 v102.92,46.1 v115.37,46.1 v127.94,46.1 v140.39,46.1 v153.21,46.1 v165.41,46.1 v170.99,46.1 | v170.99,86.23 v165.91,86.23 v152.73,86.23 v140.34,86.23 v128.08,86.23 v115.11,86.23 v102.53,86.23 v90.01,86.23 v77.37,86.23 77.24,86.11 67.36,86.11 65.97,87.5 65.97,91.95 U6.8
M8RXD
  Top 0.305: U4.1 9.4,97.42 R11.1
  Top 0.406: U4.1 9.42,100.06
M8TXD
  Top 0.305: 12.04,100.06 U4.5 12,97.38 R12.1
N$1
  Top 0.305: U10.1 72.88,93.19 R4.2
N$2
  Top 0.305: L.P$1 R1.2
N$3
  cutout Top: 1.64,28.19 40.12,28.19 arc-90 40.69,27.63 40.69,16.82 arc-90 40.12,16.26 1.64,16.26 arc-90 1.07,16.82 1.07,27.63 arc-90
N$4
  Top 0.406: U3.4 15.78,76.58 15.09,77.27
  Top 0.61: L3.2 19.23,84.91 15.09,84.91 | 15.09,84.91 C6.+ | L1.1 11.7,75.31 13.13,75.31 15.09,77.27 15.09,84.91
N$5
  Top 0.305: U12.1 97.65,93.19 R14.2
N$6
  Top 0.254: Q2.1 38.66,40.55 U1.34
  Top 0.305: C2.2 40.83,34.8 Q2.1
N$7
  Top 0.254: Q2.2 38.16,40.55 U1.33
  Top 0.305: C3.2 Q2.2
N$8
  Top 0.305: U13.1 110.1,93.19 R15.2
N$9
  Top 0.305: U16.1 147.69,93.19 R18.2
N$10
  Top 0.305: U14.1 123.18,93.19 R16.2
N$11  (via drill 0.48)
  Top 0.61: X5.1 119.69,111.84 v119.69,98.04 | v129.47,98.04 129.72,98.04 129.72,90.42 128.08,90.42 U14.5
  Bottom 0.61: v119.69,98.04 v129.47,98.04
N$12
  Top 0.305: U15.1 135.5,93.19 R17.2
N$13
  Top 0.305: U11.1 85.08,93.19 R13.2
N$14  (via drill 0.6)
  Top 0.61: X7.3 82.86,14.11 82.86,23.11 81.27,23.11 v81.28,37.21 | v92.13,37.21 92.13,41.76 U31.5
  Bottom 0.61: v81.28,37.21 v92.13,37.21
N$15
  Top 0.305: 4.06,104.74 RX.P$2 5.07,105.82 12.27,105.82 12.65,106.2 U4.23
N$16
  Top 0.305: U17.1 160.89,93.19 R19.2
N$17
  Top 0.406: U37.1 160.51,44.42 R28.2
N$18
  Top 0.406: U36.1 147.94,44.42 R29.2
N$19
  Top 0.406: U35.1 135.5,44.42 R30.2
N$20
  Top 0.406: U34.1 122.92,44.42 R31.2
N$21
  Top 0.406: U33.1 110.35,44.42 R32.2
N$22
  Top 0.406: U32.1 97.9,44.42 R33.2
N$23
  Top 0.406: U31.1 85.33,44.42 R34.2
N$24
  Top 0.406: U30.1 73.65,44.42 R35.2
N$25
  Top 0.305: U20.1 72.25,68.56 R20.2
N$26
  Top 0.305: U27.1 161.02,68.56 R21.2
N$27
  Top 0.305: U26.1 147.69,68.56 R22.2
N$28
  Top 0.305: U25.1 135.5,68.56 R23.2
N$29
  Top 0.305: U24.1 123.18,68.56 R24.2
N$30
  Top 0.305: U23.1 110.1,68.56 R25.2
N$31
  Top 0.305: U22.1 97.52,68.56 R26.2
N$32
  Top 0.305: U21.1 84.82,68.56 R27.2
N$33  (via drill 0.48)
  Top 0.61: X1.1 v69.66,98.04 v69.65,98.04 | v79.05,98.04 79.05,90.53 U10.5
  Bottom 0.61: v69.65,98.04 v79.05,98.04
N$34  (via drill 0.48)
  Top 0.61: X6.1 139.37,14.11 v139.37,24.26 | v171.12,24.26 171.12,41.76 U37.5
  Bottom 0.61: v139.37,24.26 v171.12,24.26
N$35  (via drill 0.48)
  Top 0.61: X1.2 72.4,99.44 v72.44,99.44 | v91.75,99.31 91.75,90.53 U11.5
  Bottom 0.61: v72.44,99.44 72.44,99.31 v91.75,99.31
N$36  (via drill 0.48)
  Top 0.61: X1.3 75.15,100.33 v75.24,100.33 | v104.07,100.33 104.07,90.53 U12.5
  Bottom 0.61: v75.24,100.33 v104.07,100.33
N$37  (via drill 0.48)
  Top 0.61: X1.4 77.89,101.6 v77.9,101.35 | v116.77,101.35 116.77,90.53 U13.5
  Bottom 0.61: v77.9,101.35 v116.77,101.35
N$38  (via drill 0.48)
  Top 0.61: X6.3 133.94,26.16 v134.04,26.16 | v142.29,26.29 142.29,41.76 U35.5
  Bottom 0.61: v134.04,26.16 134.04,26.29 v142.29,26.29
N$39
  Top 0.61: X6.4 131.19,37.72 129.85,37.72 129.85,41.76 U34.5
N$40  (via drill 0.48)
  Top 0.61: X7.1 88.42,24.13 v88.44,24.26 | v117.15,24.26 117.15,41.76 U33.5
  Bottom 0.61: v88.44,24.26 v117.15,24.26
N$41  (via drill 0.48)
  Top 0.61: X7.2 v85.67,25.15 85.65,23.62 | v104.83,25.27 104.83,41.76 U32.5
  Bottom 0.61: v85.67,25.15 85.67,25.27 v104.83,25.27
N$42
  Top 0.61: X7.4 80.19,37.59 79.81,37.59 79.81,41.76 U30.5
N$43
  Top 0.813: U6.14 48.95,100.46 47.91,101.5 L2.1 C8.1
N$44
  Top 0.254: 11.23,25.4 30.28,25.4
N$45  (via drill 0.48)
  Top 0.61: X5.2 122.48,111.84 v122.48,99.19 | v141.66,99.19 142.04,99.19 142.04,90.55 140.34,90.55 U15.5
  Bottom 0.61: v122.48,99.19 v141.66,99.19
N$46  (via drill 0.48)
  Top 0.61: X5.3 125.27,111.84 v125.27,100.33 | v154.61,100.33 154.74,100.33 154.74,90.55 152.73,90.55 U16.5
  Bottom 0.61: v125.27,100.33 v154.61,100.33
N$47  (via drill 0.48)
  Top 0.61: X5.4 127.89,101.35 v127.94,101.35 | v167.95,101.35 167.95,90.53 U17.5
  Bottom 0.61: v127.94,101.35 v167.95,101.35
N$48
  Top 0.61: L3.1 32.38,86.54 34.85,84.07 34.85,83.82 | 34.85,83.82 34.85,80.4 U3.8 | D5.C 34.97,83.94 34.85,83.82
N$49  (via drill 0.48)
  Top 0.61: X6.2 136.68,25.27 v136.7,25.27 | v154.74,25.27 154.74,41.76 U36.5
  Bottom 0.61: v136.7,25.27 v154.74,25.27
N$50
  Top 0.305: U2.23 12.58,38.78 14.15,37.21 15.42,37.21 RX1.P$2
N$51
  Top 0.406: U5.P$4 44.54,11.21 43.38,10.06 | 43.38,10.06 J3.T | J3.R 44.6,8.84 43.38,10.06
N$52
  Top 0.305: U2.22 11.93,38.41 TX1.P$2
N$53
  Top 0.305: U4.22 13.3,105.96 12.62,105.28 7.08,105.28 TX.P$2
N$54
  Top 0.305: RX.P$1 3.74,102.45 R7.1
N$55
  Top 0.305: R9.1 TX.P$1
N$56
  Top 0.254: R37.2 37.95,5.2 38.2,4.78 49.96,4.78 49.96,9.91 U$28.P$2
N$57
  Top 0.254: R38.2 U$28.P$4
N$58
  Top 0.305: R3.1 RX1.P$1
N$59
  Top 0.254: U5.P$1 44.54,25.27 R39.2
N$60
  Top 0.406: X4.1 27.99,115.82 27.99,117.22 28.63,117.86 32.44,117.86 33.58,116.71 33.58,112.65 30,109.07 28.04,109.07 27.91,108.94 F1.2
N$61
  Top 0.406: U5.P$3 40.49,13.01 39.68,12.19 39.68,8.18 J3.S
N$62
  Top 0.305: R6.1 TX1.P$1
N$63
  Top 0.406: J4.1 5.92,46.13 6.66,46.86 6.66,51.61 F2.2
N$66
  Top 0.305: U2.2 15.18,47.1 15.93,46.35 19.99,46.35 20.75,45.59 RESET-EN.1 RESET-EN.2 C26.1
N$68
  Top 0.305: U4.19 15.25,111.84 R8.2 15.04,112.05 R10.1 16.79,114.34 C16.2
PB1
  Top 0.254: U1.20 27.29,48.33 ICSP.3
PB2
  Top 0.254: U1.21 25.25,47.83 ICSP.4
PB3
  Top 0.254: U1.22 27.45,47.33 ICSP.1
PB7
  Top 0.254: R1.1 30.79,40.89 31.55,41.66 33.2,41.66 33.83,42.29 33.83,43.43 34.23,43.83 U1.26
PROG_D+
  Top 0.305: J4.3 6.53,44.83 7.38,43.98 U2.15
PROG_D-
  Top 0.305: J4.2 7.02,45.48 8.03,44.47 U2.16
RESET  (via drill 0.41)
  Top 0.254: U1.30 36.66,44.92 36.37,45.21 34.47,45.21 33.33,44.07 33.33,42.55 32.95,42.16 29.97,42.16 27.84,40.03
  Top 0.305: 27.84,36.7 S1.4 27.84,40.03 26.4,41.47 R5.1 26.4,44.26 v26.34,44.32 | 27.84,36.7 S1.3 27.84,29.34 C11.1 | C26.2 27.82,36.72 27.84,36.7
  Bottom 0.305: ICSP.5 25.32,50.29 25.32,45.34 v26.34,44.32
ROW1  (via drill 0.48)
  Top 0.61: X7.8 v69.2,16.13 | v180.39,16.26 v180.39,54.86 v180.39,109.47 | X6.8 120.22,16.1 v120.19,16.13 | v88.95,109.47 88.95,111.84 X1.8 | X5.8 138.87,109.47 v138.99,109.47 | 79.05,63.5 77.44,63.5 U20.4 | 79.05,63.5 v79.05,54.86 | U20.6 79.05,68.43 79.05,63.5
  Bottom 0.61: v69.2,16.13 v120.19,16.13 180.14,16.13 v180.39,16.26 | v180.39,109.47 v138.99,109.47 v88.95,109.47 | v79.05,54.86 v180.39,54.86
ROW2  (via drill 0.48)
  Top 0.61: X7.9 87.05,22.48 v87.05,23.24 | X6.9 138.05,22.48 v138.04,23.24 | X5.9 121.04,102.49 v120.83,102.36 | v71.05,102.36 71.05,114.32 X1.9 | v172.26,23.24 v172.26,68.43 v172.26,102.36 | U27.6 v167.44,68.43 167.44,63.5 165.78,63.5 U27.4
  Bottom 0.61: v87.05,23.24 v138.04,23.24 v172.26,23.24 | v71.05,102.36 v120.83,102.36 v172.26,102.36 | v167.44,68.43 v172.26,68.43
ROW3  (via drill 0.48)
  Top 0.61: X6.10 135.31,21.46 v135.31,22.23 | v73.71,103.38 73.71,114.38 X1.10 | v173.41,22.23 v173.41,61.21 v173.41,103.25 | v84.25,22.23 84.25,11.57 X7.10 | X5.10 123.78,103.38 v123.75,103.38 | U26.6 154.23,68.43 154.23,63.5 | 154.23,63.5 153.28,63.5 U26.4 | 154.23,63.5 v154.23,61.09
  Bottom 0.61: v84.25,22.23 v135.31,22.23 v173.41,22.23 | v73.71,103.38 v123.75,103.38 173.41,103.38 v173.41,103.25 | v154.23,61.09 173.41,61.09 v173.41,61.21
ROW4  (via drill 0.48)
  Top 0.61: X6.11 132.56,20.45 v132.58,21.21 | v76.51,104.39 X1.11 | v174.55,21.21 v174.55,59.94 v174.55,104.39 | X7.11 81.56,21.21 v81.33,21.21 | X5.11 126.52,104.39 v126.54,104.39 | U25.6 142.04,68.43 142.04,63.5 | 142.04,63.5 140.78,63.5 U25.4 | 142.04,63.5 v142.04,59.94
  Bottom 0.61: v81.33,21.21 v132.58,21.21 v174.55,21.21 | v76.51,104.39 v126.54,104.39 v174.55,104.39 | v142.04,59.94 v174.55,59.94
ROW5  (via drill 0.48)
  Top 0.61: X5.12 129.26,105.41 v129.08,105.41 | v79.3,105.41 79.3,114.38 X1.12 | v175.69,20.19 v175.69,58.93 v175.69,105.41 | X7.12 78.82,20.19 v78.67,20.19 | v129.72,20.19 129.72,11.57 X6.12 | 129.72,63.48 v129.72,58.93 | U24.4 129.72,63.48 | 129.72,63.48 129.72,68.45 128.03,68.45 U24.6
  Bottom 0.61: v78.67,20.19 v129.72,20.19 v175.69,20.19 | v79.3,105.41 v129.08,105.41 v175.69,105.41 | v129.72,58.93 v175.69,58.93
ROW6  (via drill 0.48)
  Top 0.61: X7.13 76.07,18.54 v76.06,19.18 | X6.13 127.08,18.54 v127.12,19.18 | X5.13 132.01,106.43 v131.75,106.43 | v82.09,106.43 82.09,114.38 X1.13 | v176.84,19.18 v176.84,57.91 | v176.84,57.91 v176.84,106.43 | U23.6 117.02,68.43 117.02,63.5 | 117.02,63.5 115.78,63.5 | 117.02,63.5 v117.02,57.91 | v176.84,57.91 176.84,56.77
  Top 0.813: 115.78,63.5 U23.4
  Bottom 0.61: v76.06,19.18 v127.12,19.18 v176.84,19.18 | v82.09,106.43 v131.75,106.43 v176.84,106.43 | v117.02,57.91 v176.84,57.91
ROW7  (via drill 0.48)
  Top 0.61: X6.14 124.33,17.02 v124.32,18.16 | X5.14 134.75,107.44 v134.93,107.44 | v84.76,107.44 84.76,114.38 X1.14 | X7.14 73.33,17.59 v73.33,18.22 | v177.98,18.16 v177.98,56.9 | v177.98,56.9 v177.98,107.44 | U22.6 104.07,68.43 104.07,63.5 | 104.07,63.5 103.28,63.5 | 104.07,63.5 v104.07,56.9 | v177.98,56.9 177.98,55.5
  Top 0.813: 103.28,63.5 U22.4
  Bottom 0.61: v73.33,18.22 73.2,18.16 v124.32,18.16 v177.98,18.16 | v84.76,107.44 v134.93,107.44 v177.98,107.44 | v104.07,56.9 v177.98,56.9
ROW8  (via drill 0.48)
  Top 0.61: X5.15 137.5,108.46 v137.85,108.46 | v87.43,108.46 87.43,114.38 X1.15 | X7.15 70.59,17.14 v70.54,17.14 | v179.12,17.14 v179.12,55.88 v179.12,108.46 | 91.62,63.5 91.75,63.5 v91.75,55.88 | 91.62,63.5 89.89,63.5 | U21.6 91.62,68.43 91.62,63.5 | X6.15 v121.59,17.14
  Top 0.813: 89.89,63.5 U21.4
  Bottom 0.61: v87.43,108.46 v137.85,108.46 v179.12,108.46 | v70.54,17.14 v121.59,17.14 | v121.59,17.14 | v121.59,17.14 v179.12,17.14 | v91.75,55.88 v179.12,55.88
RUNNING  (via drill 0.3, 0.46)
  Top 0.254: U1.52 51.26,46.33 51.74,45.85 v51.74,45.59 | v58.12,11.73 58.12,7.62 R38.1
  Bottom 0.254: v58.12,11.73 50.98,11.73 50.98,44.45 51.74,45.21 v51.74,45.59
RXD  (via drill 0.3)
  Top 0.254: U1.63 46.9,51.83 46.28,52.45 v36.5,52.45
  Top 0.305: 9.62,96.01 R11.2 9.74,95.89 JP1.1 2.08,95.89 0.56,94.36 0.56,70.36 v1.45,69.47
  Bottom 0.305: v1.45,69.47 8.56,62.36 26.72,62.36 27.36,61.72 27.36,53.72 28.63,52.45 v36.5,52.45
RXD2  (via drill 0.3)
  Top 0.254: v29.52,56.01 29.9,55.63 30.91,55.63 31.42,55.12 31.42,52.58 31.68,52.32 U1.12 | JP3.6 35.87,65.79 31.42,65.79 v29.77,64.14
  Bottom 0.254: v29.52,56.01 29.52,63.88 v29.77,64.14
RXD_PROG
  Top 0.254: U1.2 21.79,57.33 20.32,58.8
  Top 0.305: 20.32,58.8 R40.2
RXDP
  Top 0.305: R40.1 17.07,58.8 15.8,57.53 | 15.8,57.53 15.8,48.49 U2.1 | JP2.4 13.01,56.52 14.02,57.53 15.8,57.53
SCL  (via drill 0.3)
  Top 0.254: U1.43 43.16,45.15 44.12,46.1 44.12,48.26 43.49,48.9 v43.1,48.9
  Bottom 0.254: v43.1,48.9 39.3,48.9 37.9,50.29 37.9,55.37 37.39,55.88 37.39,62.23 36.88,62.74 33.83,62.74 JP3.1
SDA  (via drill 0.3)
  Top 0.254: U1.44 43.66,44.88 44.63,45.85 44.63,48.51 43.49,49.66 v42.09,49.66
  Bottom 0.254: v42.09,49.66 39.3,49.66 38.41,50.55 38.41,55.63 37.9,56.13 37.9,62.48 37.14,63.25 35.87,63.25 JP3.3
SHUTTER  (via drill 0.3, 0.41)
  Top 0.254: U1.51 50.38,45.83 v50.73,45.49 | R39.1 48.31,25.78 v48.69,26.16
  Bottom 0.254: v48.69,26.16 50.47,27.94 50.47,44.7 50.73,44.96 v50.73,45.49
SW1
  Top 0.254: U1.89 40.16,64.03 JP3.7
  Bottom 0.254: 39.68,56.01 38.91,56.01 38.41,56.52 38.41,63.25 JP3.7
  Bottom 0.305: R46.2 39.68,56.01 C46.1
SW2
  Top 0.254: U1.88 40.66,62.97 JP3.9
  Bottom 0.254: 42.22,56.01 41.33,56.01 40.95,56.39 40.95,63.25 JP3.9
  Bottom 0.305: R45.2 42.22,56.01 C45.1
SW3
  Top 0.254: U1.87 41.16,62.58 41.84,63.25 43.49,63.25 JP3.11
  Bottom 0.254: 44.76,56.01 43.87,56.01 43.49,56.39 43.49,63.25 JP3.11
  Bottom 0.305: R44.2 44.76,56.01 C44.1
SW4
  Top 0.254: U1.86 41.66,62.19 42.22,62.74 43.74,62.74 44.25,63.25 46.03,63.25 JP3.13
  Bottom 0.254: 47.3,56.01 46.41,56.01 46.03,56.39 46.03,63.25 JP3.13
  Bottom 0.305: R43.2 47.3,56.01 C43.1
SW5
  Top 0.254: U1.85 42.16,61.8 42.6,62.23 43.99,62.23 44.5,62.74 46.28,62.74 46.79,63.25 48.57,63.25 JP3.15
  Bottom 0.254: 49.84,56.01 48.95,56.01 48.57,56.39 48.57,63.25 JP3.15
  Bottom 0.305: R42.2 49.84,56.01 C42.1
TXD  (via drill 0.3)
  Top 0.254: U1.64 47.29,52.33 46.41,53.21 v35.61,53.21
  Top 0.305: R12.2 11.99,94.74 10.59,93.34 JP1.2 2.21,93.34 1.2,92.33 1.2,70.87 v1.58,70.48
  Bottom 0.305: v1.58,70.48 9.07,62.99 26.98,62.99 27.99,61.98 27.99,53.98 28.75,53.21 v35.61,53.21
TXD2  (via drill 0.3)
  Top 0.254: v30.41,54.61 30.66,54.36 30.66,52.58 31.41,51.83 U1.13
  Bottom 0.254: v30.41,54.61 30.28,54.86 30.28,62.48 30.79,62.99 30.79,65.15 31.42,65.79 35.87,65.79 JP3.5
TXD_PROG
  Top 0.254: U1.3 20.27,56.83
  Top 0.305: 20.27,56.83 R41.2
TXDP  (via drill 0.3)
  Top 0.305: R41.1 v16.69,56.77 | U2.5 13.23,55.85 13.21,55.88 | v14.91,56.77 14.15,56.77 13.26,55.88 13.21,55.88 | JP2.5 3.48,53.98 5.39,55.88 13.21,55.88
  Bottom 0.305: v14.91,56.77 v16.69,56.77
USBPROGVCC  (via drill 0.41)
  Top 0.305: U2.19 U2.20 | U2.20 10.63,44.49 v11.36,45.21 13.89,45.21 | C25.1 13.88,50.42 U2.4 13.88,45.33 13.89,45.21 | U2.20 10.63,39.68 C32.1 C31.1 C30.1 9.56,30.88 10.65,29.78 R6.2 R3.2 | C18.1 17.7,45.21 13.89,45.21
  Top 0.406: 11.23,51.9 F2.1 11.23,52.32 v11.23,54.99 | D4.2 5.94,59.05 | 5.94,59.05 JP2.3 | v10.34,59.05 5.94,59.05
  Bottom 0.406: v10.34,59.05 11.23,58.17 v11.23,54.99 11.23,45.34 v11.36,45.21
USBVCC  (via drill 0.3, 0.41)
  Top 0.305: R9.2 R7.2 3.76,98.68 | C14.1 21.37,108.58
  Top 0.356: 21.37,108.58 v19.1,108.58 | R8.1 v16.9,110.4 | R9.2 v8.18,98.68 | D4.1 5.51,67.37 v5.51,68.58
  Top 0.406: F1.1 24.01,108.57 C14.1
  Bottom 0.356: 18.34,108.58 v19.1,108.58 16.9,108.58 | 16.9,108.58 10.59,108.58 8.94,106.93 8.94,99.44 v8.18,98.68 5.51,96.01 v5.51,68.58 | v16.9,110.4 16.9,108.58
VIN
  Top 0.61: C5.+ 41.8,79.12 U3.7
  Top 0.762: C12.1 56.06,101.85
  Top 0.813: L2.2 56.06,101.85
  Top 1.016: D2.1 56.08,106.86 56.06,106.83 56.06,101.85 56.06,82.3 52.81,79.04 C5.+
VPWR
  Top 1.27: J1.3 51.14,115.85 54.89,119.61 54.89,123.53 D2.2

## Text on the board
Top: RTIduino | v1.2 | University of Southampton | Phil Basford, Graeme Bragg, / Kirk Martinez
tNames: 1.RXD | 2.TXD | 3.GND | 5V | G | R | G | G | G | G | G | 1.GND | C | D | T | 1 | 2 | 3 | 4 | 5 | 3.VCC | 4.TXD | 5.RXD | GND.6 | 5.!RST | SI.4 | 3.SCK | VCC.2 | 1.MI | U5